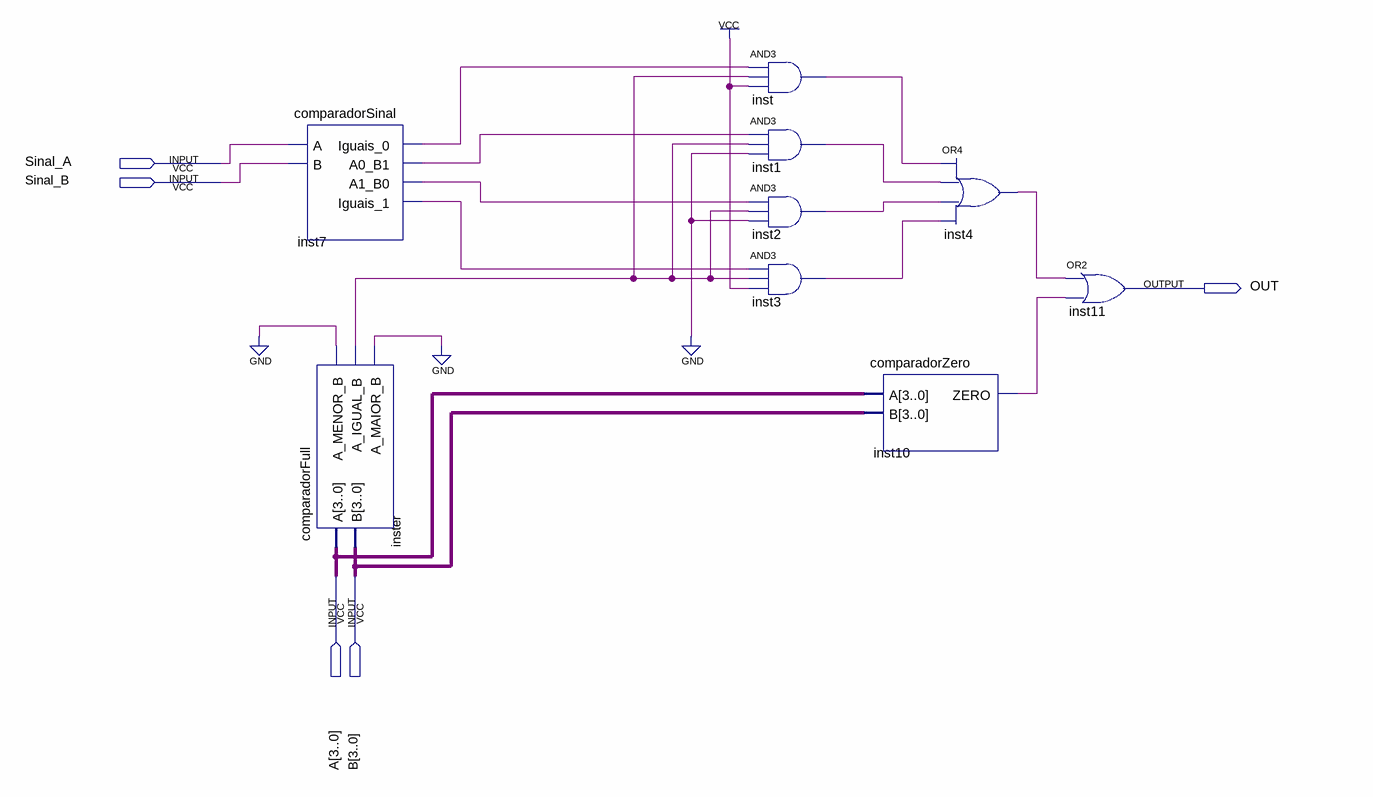
[diagram p0: schematic sheet]
// Quartus schematic comparadorIgual.bdf as structural Verilog: 9 symbols, 5 pins
module comparadorIgual (
  input  Sinal_A,
  input  Sinal_B,
  input  [3:0] A,
  input  [3:0] B,
  output OUT
);

  wire inst1_out, inst2_out, inst3_out, inst4_out, inst7_a0_b1, inst7_a1_b0, inst7_iguais_0, inst7_iguais_1,
       inst10_zero, inst_out, inster_a_igual_b, inster_a_maior_b, inster_a_menor_b;

  comparadorSinal inst7 (
    .A(Sinal_A), .B(Sinal_B), .Iguais_0(inst7_iguais_0), .A0_B1(inst7_a0_b1), .A1_B0(inst7_a1_b0),
    .Iguais_1(inst7_iguais_1));
  comparadorFull inster (
    .A(A), .B(B), .A_MENOR_B(inster_a_menor_b), .A_IGUAL_B(inster_a_igual_b), .A_MAIOR_B(inster_a_maior_b));
  and inst (inst_out, inst7_iguais_0, inster_a_igual_b, 1'b1);
  and inst1 (inst1_out, inst7_a0_b1, inster_a_igual_b, 1'b0);
  and inst2 (inst2_out, inst7_a1_b0, inster_a_igual_b, 1'b0);
  and inst3 (inst3_out, inst7_iguais_1, inster_a_igual_b, 1'b1);
  comparadorZero inst10 (.A(A), .B(B), .ZERO(inst10_zero));
  or inst4 (inst4_out, inst_out, inst1_out, inst2_out, inst3_out);
  or inst11 (OUT, inst4_out, inst10_zero);
  // also tied to GND on the sheet: {inster_a_menor_b, inster_a_maior_b}
endmodule
